# EAGLE design pengaduk pupuk (EAGLE 9.2.0)
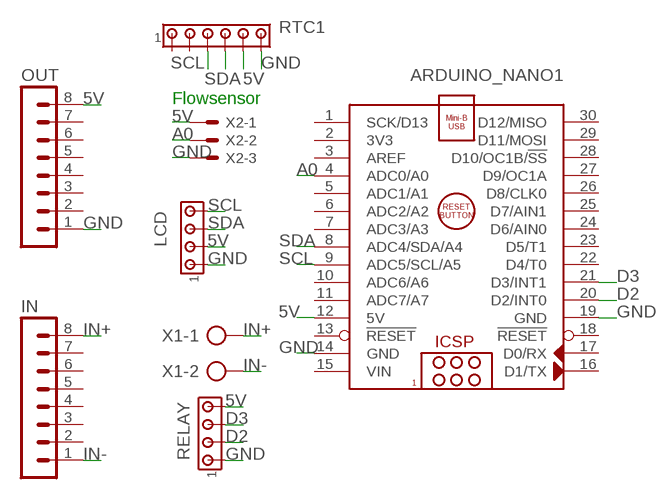
[diagram p0: schematic, sheet 1]

## Parts
ARDUINO_NANO1  ARDUINO_NANO  [ARDUINO_NANO]
IN  MA08-1  [MA08-1]
LCD  MTA04-100  [10X04MTA]
OUT  MA08-1  [MA08-1]
RELAY  MTA04-100  [10X04MTA]
RTC1  MTA06-100  [10X06MTA]
X1  AK500/2-H  [AK500/2-H]
X2  KK-156-3  [KK-156-3]

## Nets
5V: ARDUINO_NANO1.12(5V) LCD.2 OUT.8 RELAY.4 RTC1.5 X2.1
A0: ARDUINO_NANO1.4(ADC0/A0) X2.2
D2: ARDUINO_NANO1.20(D2/INT0) RELAY.2
D3: ARDUINO_NANO1.21(D3/INT1) RELAY.3
GND: ARDUINO_NANO1.14(GND) ARDUINO_NANO1.19(GND) LCD.1 OUT.1 RELAY.1 RTC1.6 X2.3
IN+: IN.8 X1.1
IN-: IN.1 X1.2
SCL: ARDUINO_NANO1.9(ADC5/SCL/A5) LCD.4 RTC1.3
SDA: ARDUINO_NANO1.8(ADC4/SDA/A4) LCD.3 RTC1.4
Unconnected: ARDUINO_NANO1.1(SCK/D13) ARDUINO_NANO1.2(3V3) ARDUINO_NANO1.3(AREF) ARDUINO_NANO1.5(ADC1/A1) ARDUINO_NANO1.6(ADC2/A2) ARDUINO_NANO1.7(ADC3/A3) ARDUINO_NANO1.10(ADC6/A6) ARDUINO_NANO1.11(ADC7/A7) ARDUINO_NANO1.13(!RESET) ARDUINO_NANO1.16(D1/TX) ARDUINO_NANO1.17(D0/RX) ARDUINO_NANO1.18(!RESET) ARDUINO_NANO1.22(D4/T0) ARDUINO_NANO1.23(D5/T1) ARDUINO_NANO1.24(D6/AIN0) ARDUINO_NANO1.25(D7/AIN1) ARDUINO_NANO1.26(D8/CLK0) ARDUINO_NANO1.27(D9/OC1A) ARDUINO_NANO1.28(D10/OC1B/!SS) ARDUINO_NANO1.29(D11/MOSI) ARDUINO_NANO1.30(D12/MISO) IN.2 IN.3 IN.4 IN.5 IN.6 IN.7 OUT.2 OUT.3 OUT.4 OUT.5 OUT.6 OUT.7 RTC1.1 RTC1.2

## Notes on the sheet
- Flowsensor

## Power pins joined to a net without a drawn wire
VIN: ARDUINO_NANO1.15(VIN)

## Library data of the parts
ARDUINO_NANO1 = ArduinoNanoV30:ARDUINO_NANO: Arduino Nano V3.0 Module Overview: The Arduino Nano is a small, complete, and breadboard-friendly board based on the ATmega328 (Arduino Nano 3.x) or ATmega168 (Arduino Nano 2.x). It has more or less the same functionality of the Arduino Duemilanove, but in a different package. It lacks only a DC power jack, and works with a Mini-B USB cable instead of a standard one. The Nano was designed and is being produced by Gravitech <http://www.gravitech.us/arna30wiatp.html>. General specifications: Item Value Microcontroller Atmel ATmega168 or ATmega328 Operating Voltage (logic level) 5 V Input Voltage (recommended) 7-12 V Input Voltage (limits) 6-20 V Digital I/O Pins 14 (of which 6 provide PWM output) Analog Input Pins 8 DC Current per I/O Pin 40 mA Flash Memory 16 KB (ATmega168) or 32 KB (ATmega328) of which 2 KB used by bootloader SRAM 1 KB (ATmega168) or 2 KB (ATmega328) EEPROM 512 bytes (ATmega168) or 1 KB (ATmega328) Clock Speed 16 MHz Dimensions (Inches) 0.73" x 1.70" Dimensions (mm) 18mm x 45mm Overall height About 9 mm (not including pins) Weigth 5 g Power: The Arduino Nano can be powered via the Mini-B USB connection, 6-20V unregulated external power supply (pin 30), or 5V regulated external power supply (pin 27). The power source is automatically selected to the highest voltage source. Memory: The ATmega168 has 16 KB of flash memory for storing code (of which 2 KB is used for the bootloader); the ATmega328 has 32 KB, (also with 2 KB used for the bootloader). The ATmega168 has 1 KB of SRAM and 512 bytes of EEPROM (which can be read and written with the EEPROM library); the ATmega328 has 2 KB of SRAM and 1 KB of EEPROM. Input and Output: Each of the 14 digital pins on the Nano can be used as an input or output, using pinMode(), digitalWrite(), and digitalRead() functions. They operate at 5 volts. Each pin can provide or receive a maximum of 40 mA and has an internal pull-up resistor (disconnected by default) of 20-50 kOhms. In addition, some pins have specialized functions. Visit Arduino - ArduinoBoardNano <https://www.arduino.cc/en/Main/ArduinoBoardNano>
IN OUT = con-lstb:MA08-1: PIN HEADER; OC_FARNELL: unknown; OC_NEWARK: unknown
LCD RELAY = con-amp:MTA04-100: AMP connector
RTC1 = con-amp:MTA06-100: AMP connector Connection corrected 2014-09-19
X1 = con-ptr500:AK500/2-H: CONNECTOR Aug. 2004 / PTR Meßtechnik: Die Bezeichnung der Serie AK505 wurde geändert. Es handelt sich hierbei um AK500 in horizontaler Ausführung.; OC_FARNELL: unknown; OC_NEWARK: unknown
X2 = con-molex:KK-156-3: KK 156 HEADER Source: http://www.molex.com/pdm_docs/sd/026604100_sd.pdf; MF: MOLEX; OC_FARNELL: unknown; OC_NEWARK: unknown

## Board
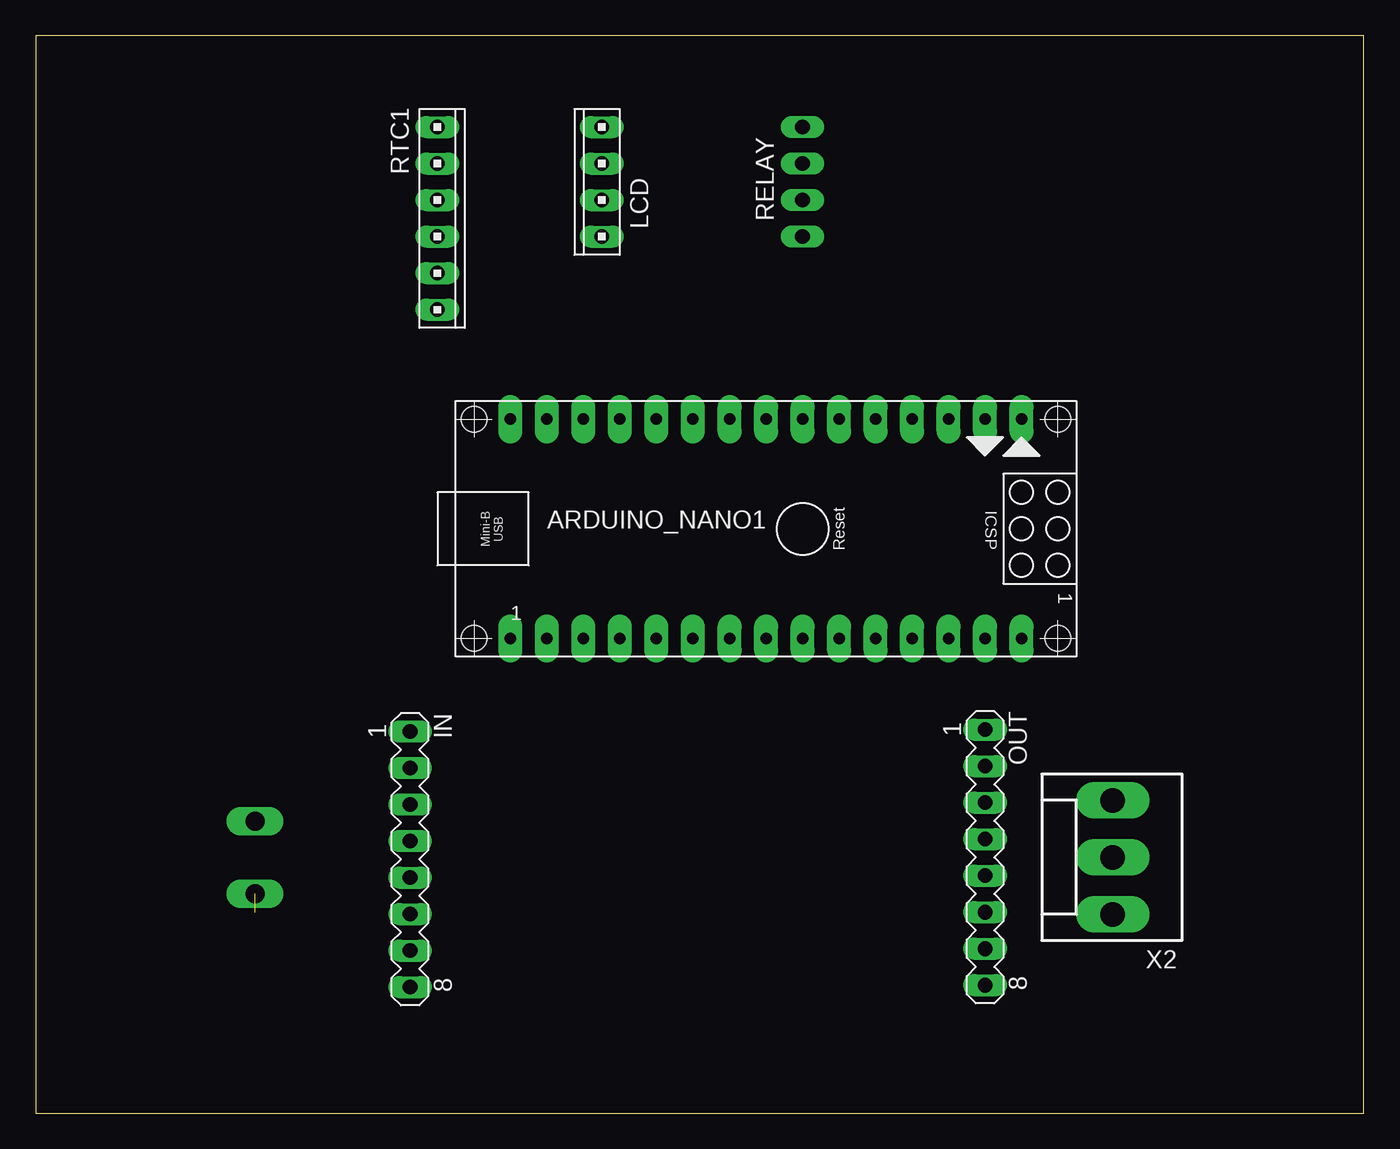
[diagram p1: board, top side]
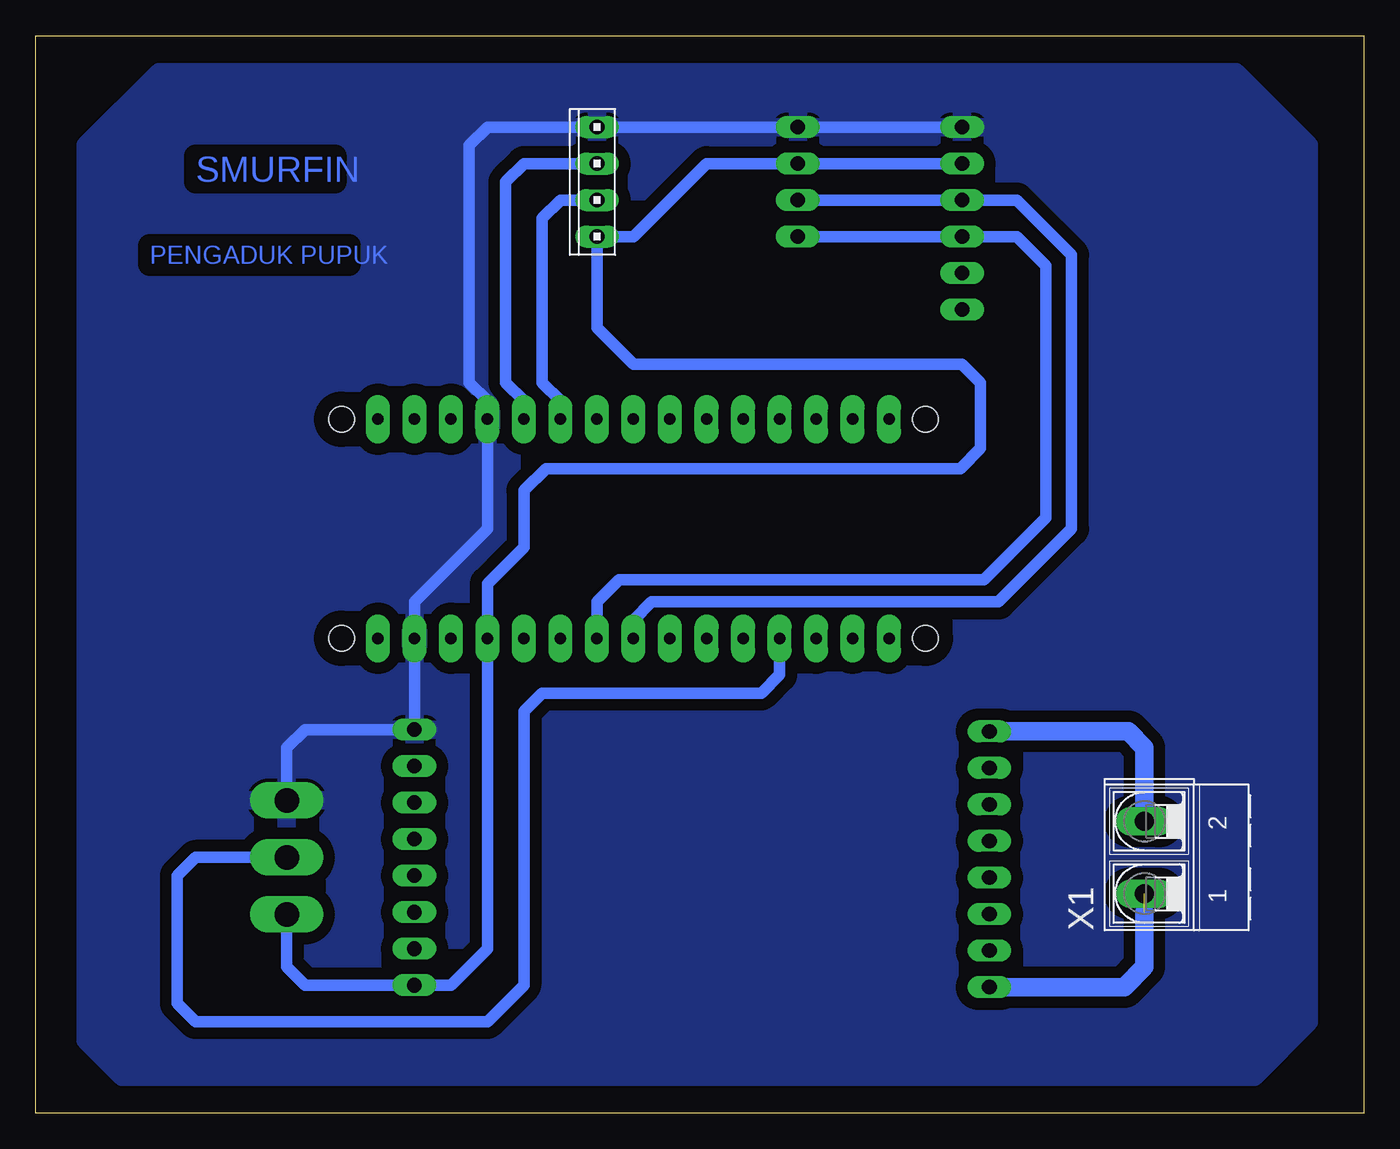
[diagram p2: board, bottom side, seen from below]

Size 92.38 x 74.92 mm. Coordinates in mm from the lower left corner, seen from the top.
Outline: 0,0 92.38,0 92.38,74.92 0,74.92 0,0
Copper layers (1*16): Top 0.035mm / dielectric 1.5mm / Bottom 0.035mm
Design rules "default": minimum track width 6mil, minimum drill 0.35mm, track to track 6mil, track to pad 6mil, pad to pad 6mil, via to via 6mil, smd to smd 6mil, copper to edge 40mil, drill to drill 6mil, minimum pad ring 10mil, minimum via ring 8mil, stop-mask expansion 4mil, vias tented up to drill 0mil, thermal gap 10mil

### Footprints (pad centres in the part's own frame; a part is rotated, then mirrored left to right if it is on the bottom)
ARDUINO_NANO = drill 0.8 pad 1.676 long: 1 -20.32,-7.62; 2 -17.78,-7.62; 3 -15.24,-7.62; 4 -12.7,-7.62; 5 -10.16,-7.62; 6 -7.62,-7.62; 7 -5.08,-7.62; 8 -2.54,-7.62; 9 0,-7.62; 10 2.54,-7.62; 11 5.08,-7.62; 12 7.62,-7.62; 13 10.16,-7.62; 14 12.7,-7.62; 15 15.24,-7.62; 16 15.24,7.62; 17 12.7,7.62; 18 10.16,7.62; 19 7.62,7.62; 20 5.08,7.62; 21 2.54,7.62; 22 0,7.62; 23 -2.54,7.62; 24 -5.08,7.62; 25 -7.62,7.62; 26 -10.16,7.62; 27 -12.7,7.62; 28 -15.24,7.62; 29 -17.78,7.62; 30 -20.32,7.62 | hole 1.778: -22.86,-7.62; -22.86,7.62; 17.78,7.62; 17.78,-7.62
MA08-1 = drill 1.016 long: 1 -8.89,0; 2 -6.35,0; 3 -3.81,0; 4 -1.27,0; 5 1.27,0; 6 3.81,0; 7 6.35,0; 8 8.89,0
10X04MTA = drill 1.016 long: 1 3.81,0; 2 1.27,0; 3 -1.27,0; 4 -3.81,0
10X06MTA = drill 1.016 long: 1 6.35,0; 2 3.81,0; 3 1.27,0; 4 -1.27,0; 5 -3.81,0; 6 -6.35,0
AK500/2-H = drill 1.321 long: 1 -2.515,0; 2 2.515,0
KK-156-3 = drill 1.7 pad 2.184 long: 1 -3.96,0; 2 0,0; 3 3.96,0

### Placement (x,y rotation side)
ARDUINO_NANO1  53.34,40.64 0 top
IN  26.04,17.65 270 top
LCD  39.37,64.77 90 top
OUT  66.04,17.78 270 top
RELAY  53.34,64.77 90 bottom
RTC1  27.94,62.23 270 top
X1  15.24,17.78 90 bottom
X2  74.93,17.78 90 top

### Tracks (layer width: path | path; a pad name or v marks a point on that pad's centre or on a via)
5V
  Bottom 0.813: RTC1.5 LCD.2 45.72,66.04 50.8,60.96 RELAY.4 53.34,54.61 50.8,52.07 27.94,52.07 26.67,50.8 26.67,46.23 28.07,44.83 56.9,44.83 58.42,43.31 58.42,39.37 60.96,36.83 ARDUINO_NANO1.12 60.96,11.43 63.5,8.89 OUT.8 73.66,8.89 74.93,10.16 X2.1
A0
  Bottom 0.813: X2.2 81.28,17.78 82.55,16.51 82.55,7.62 81.28,6.35 60.96,6.35 58.42,8.89 58.42,27.94 57.15,29.21 41.91,29.21 40.64,30.48 ARDUINO_NANO1.4
D2
  Bottom 0.813: RELAY.2 58.42,66.04 59.69,64.77 59.69,50.8 58.42,49.53 ARDUINO_NANO1.20
D3
  Bottom 0.813: RELAY.3 55.88,63.5 57.15,62.23 57.15,50.8 55.88,49.53 ARDUINO_NANO1.21
GND
  Bottom 0.813: RTC1.6 LCD.1 RELAY.1 60.96,68.58 62.23,67.31 62.23,50.8 60.96,49.53 ARDUINO_NANO1.19 60.96,40.64 66.04,35.56 ARDUINO_NANO1.14 OUT.1 73.66,26.67 74.93,25.4 X2.3
  pour Bottom (isolate 0.813): 3.81,67.31 8.89,72.39 83.82,72.39 88.9,67.31 88.9,5.08 86.36,2.54 7.62,2.54 3.81,6.35
IN+  (1 unrouted)
  Bottom 1.27: IN.8 16.64,8.76 15.24,10.16 15.24,13.97
IN-
  Bottom 1.27: X1.2 15.24,25.4 16.38,26.54 IN.1
SCL
  Bottom 0.813: LCD.4 RTC1.3 24.13,60.96 22.1,58.93 22.1,41.4 26.42,37.08 51.82,37.08 53.34,35.56 ARDUINO_NANO1.9
SDA
  Bottom 0.813: LCD.3 RTC1.4 24.13,63.5 20.32,59.69 20.32,40.64 25.4,35.56 49.53,35.56 50.8,34.29 ARDUINO_NANO1.8

### Text on the board
Bottom: SMURFIN | PENGADUK PUPUK